# EAGLE design lcdi2c_shield (EAGLE 7.2.0)
CNAME: LCD i2c shield; CREVISION: 001; DESIGNER: M.Vagovszky
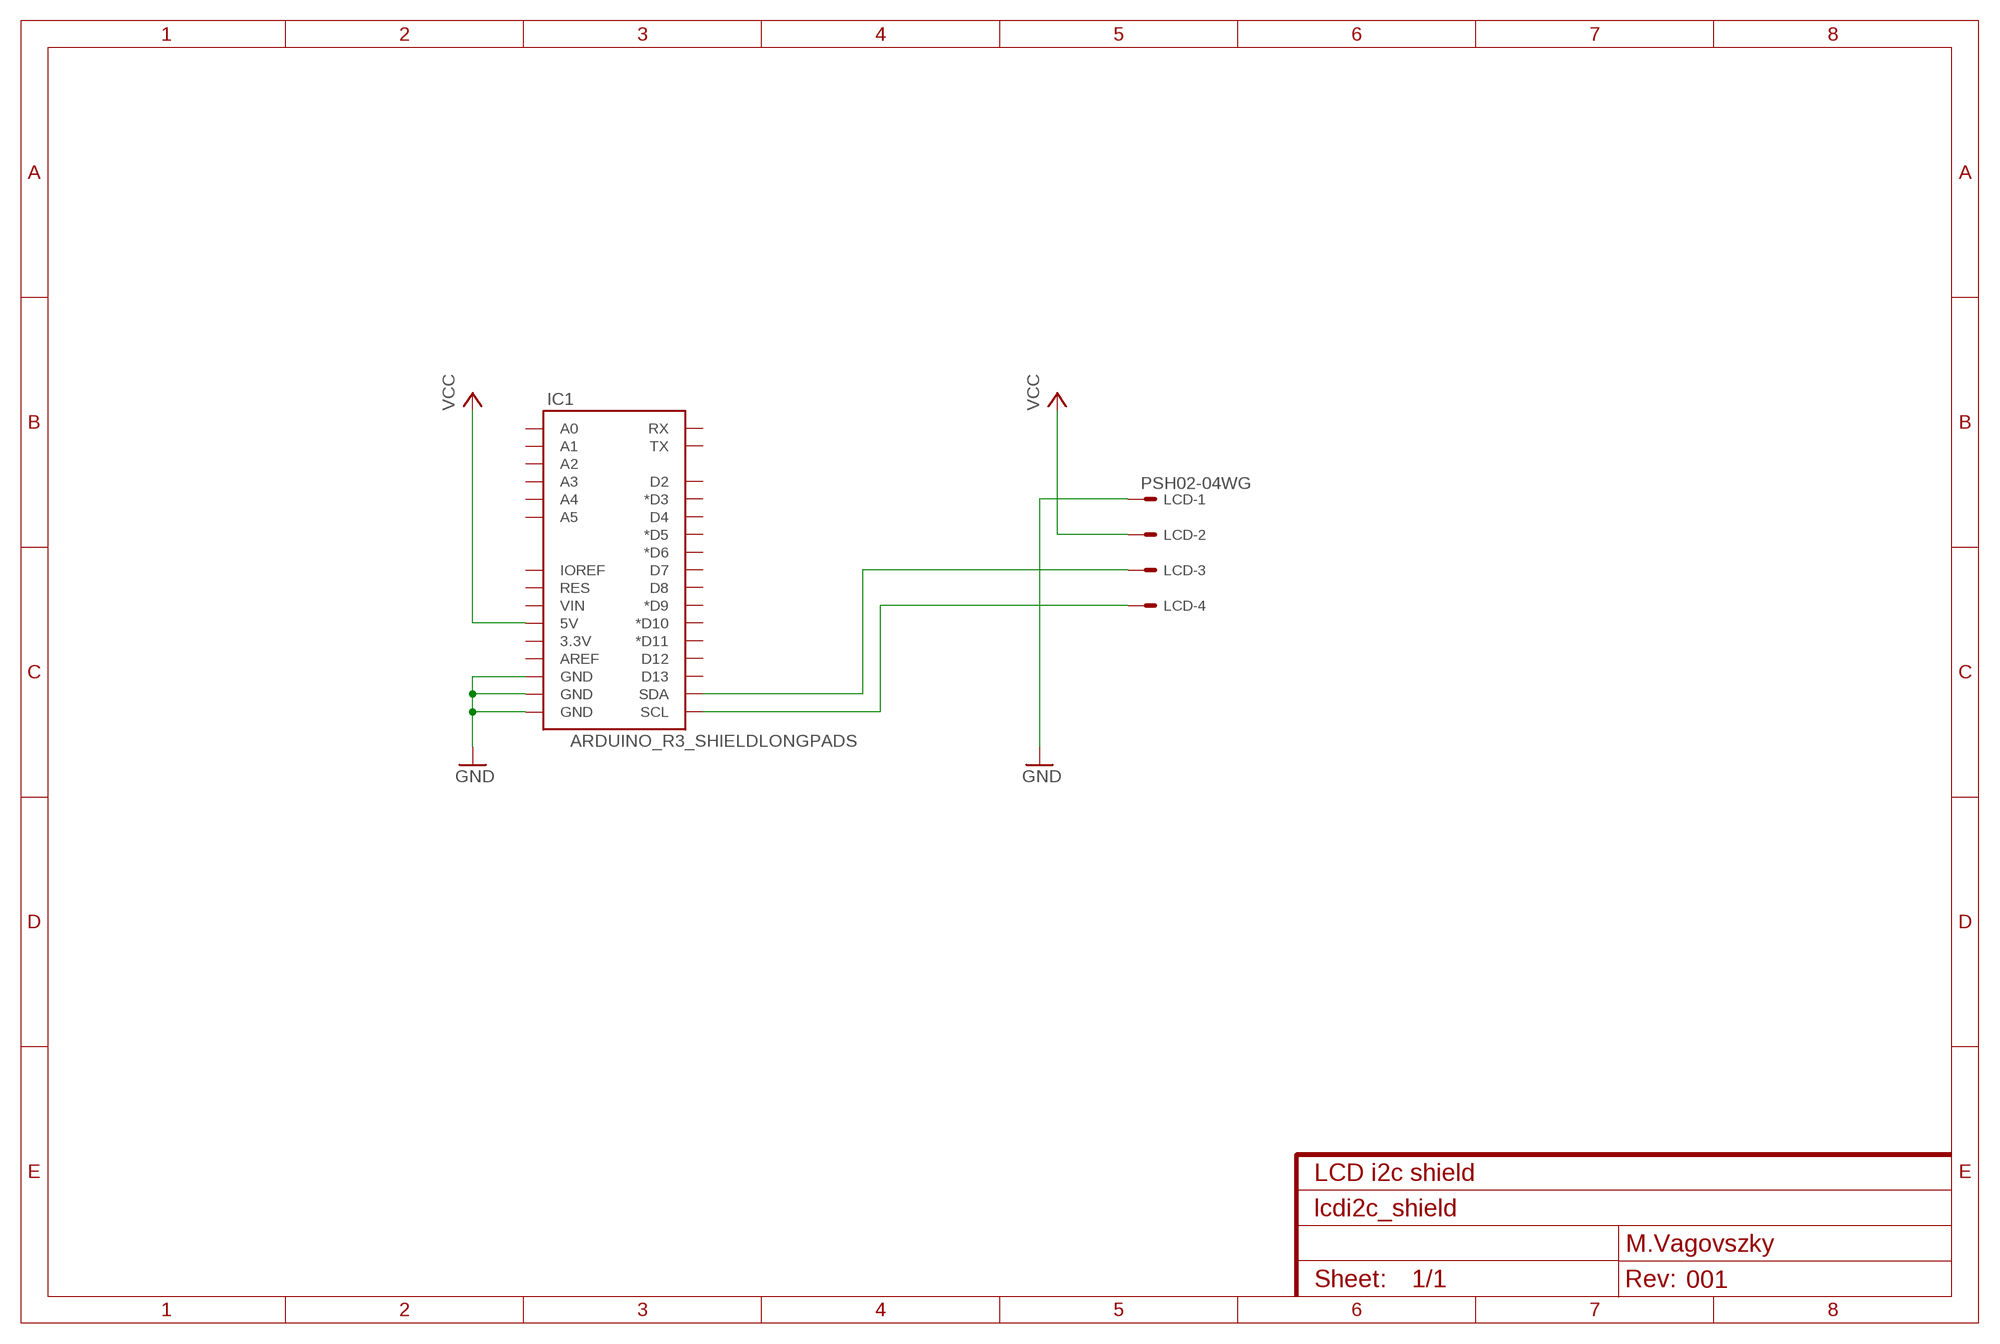
[diagram p0: schematic, sheet 1]

## Parts
IC1  ARDUINO_R3_SHIELDLONGPADS  [UNO_R3_SHIELD_LONGPADS]
LCD  PSH02-04WG  22-05-7048-04  [7395-04]

## Nets
GND: IC1.GND@0(GND) IC1.GND@1(GND) IC1.GND@2(GND) LCD.1
N$1: IC1.SDA LCD.3
N$2: IC1.SCL LCD.4
VCC: IC1.5V LCD.2
Unconnected: IC1.3.3V IC1.A0 IC1.A1 IC1.A2 IC1.A3 IC1.A4 IC1.A5 IC1.AREF IC1.D2 IC1.D3(*D3) IC1.D4 IC1.D5(*D5) IC1.D6(*D6) IC1.D7 IC1.D8 IC1.D9(*D9) IC1.D10(*D10) IC1.D11(*D11) IC1.D12 IC1.D13 IC1.IOREF IC1.RES IC1.RX IC1.TX IC1.VIN

## Library data of the parts
IC1 = My:ARDUINO_R3_SHIELD: Shield form compatible with the Arduino Uno R3.
LCD = con-molex:22-?-04: CONNECTOR wire to board 2.54 mm (.1 inch) pitch header; OC_FARNELL: unknown; OC_NEWARK: unknown

## Board
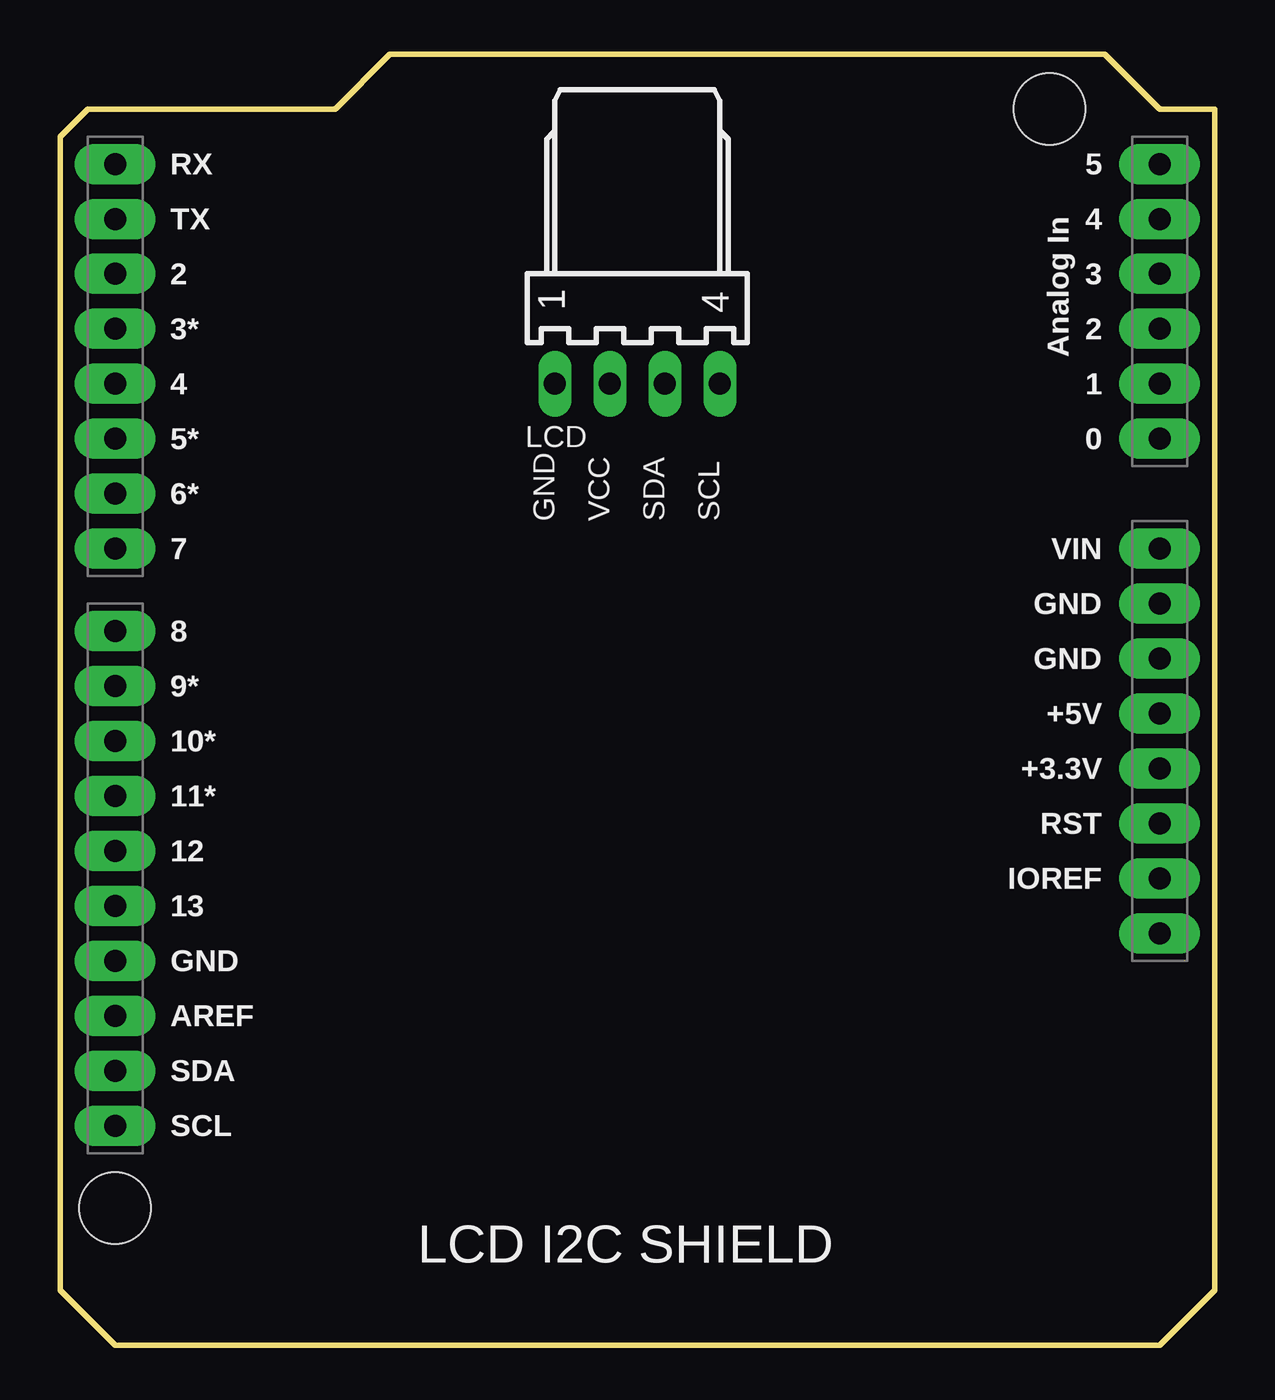
[diagram p1: board, top side]
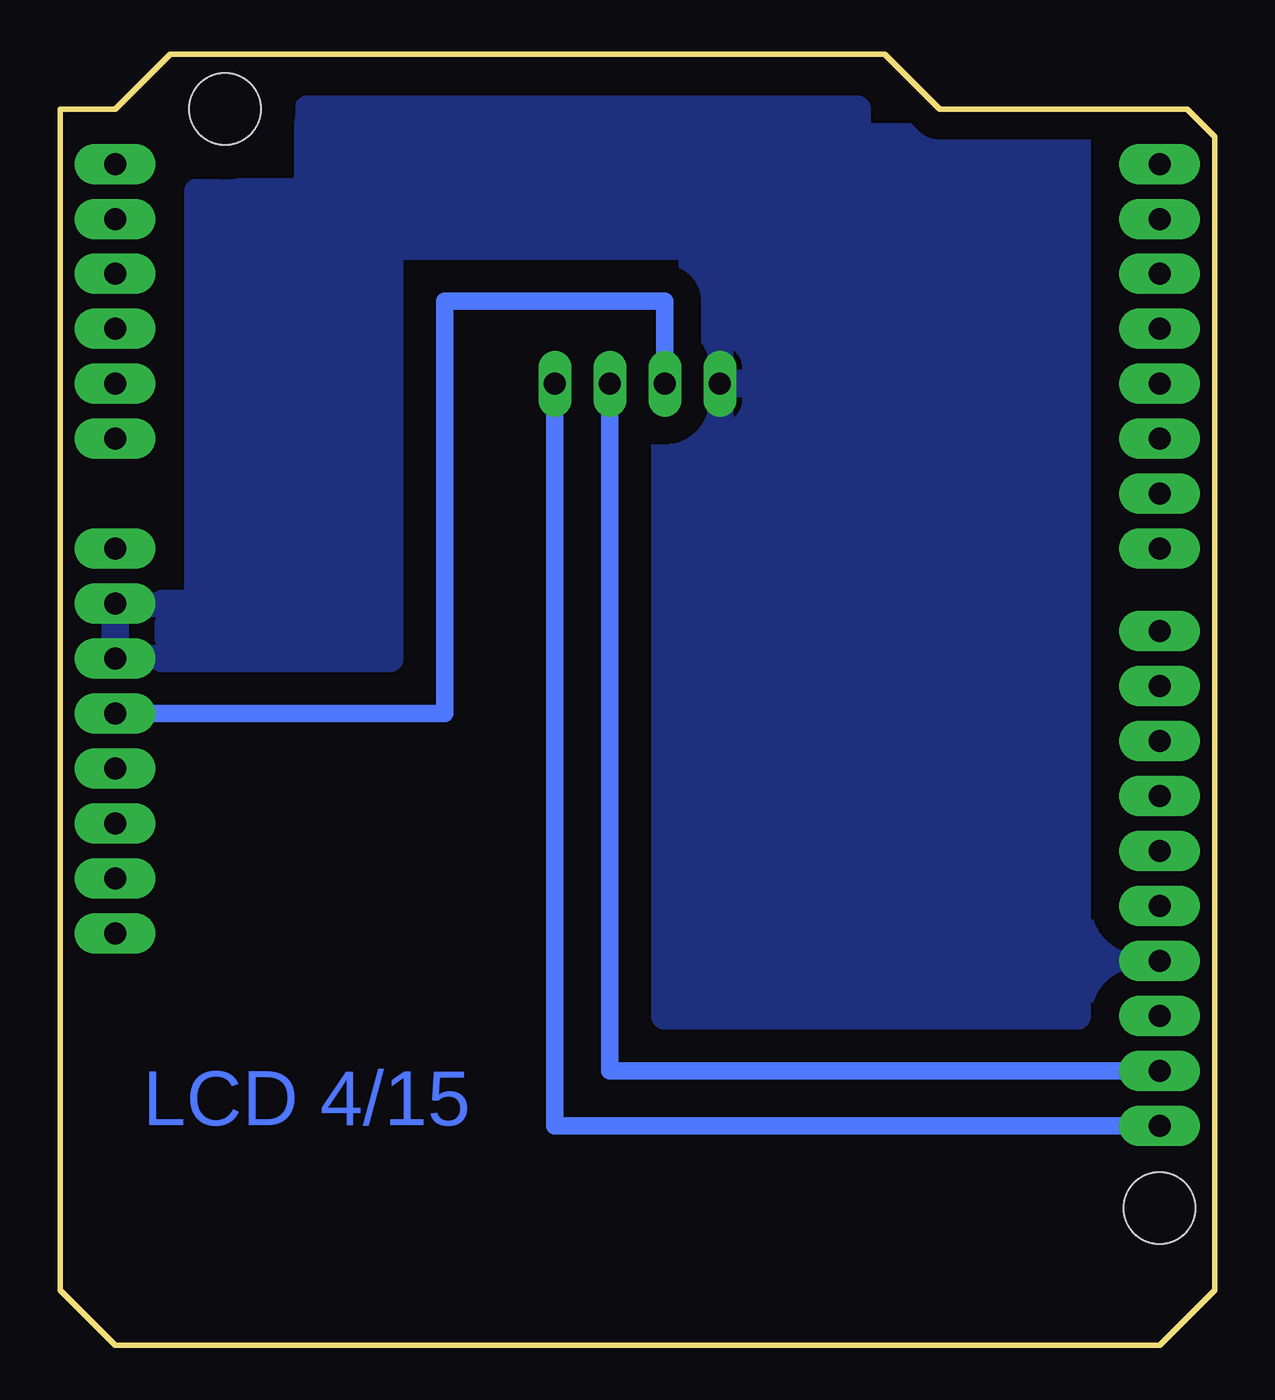
[diagram p2: board, bottom side, seen from below]

Size 53.34 x 59.69 mm. Coordinates in mm from the lower left corner, seen from the top.
Outline: 0,2.54 0,55.88 1.27,57.15 12.7,57.15 15.24,59.69 48.26,59.69 50.8,57.15 53.34,57.15 53.34,2.54 50.8,0 2.54,0 0,2.54
Copper layers (1*16): Top 0.035mm / dielectric 1.5mm / Bottom 0.035mm
Design rules "default": minimum track width 10mil, minimum drill 24mil, track to track 8mil, track to pad 8mil, pad to pad 8mil, via to via 8mil, smd to smd 8mil, copper to edge 40mil, drill to drill 8mil, minimum pad ring 10mil, minimum via ring 8mil, stop-mask expansion 4mil, vias tented up to drill 0mil, thermal gap 10mil

### Footprints (pad centres in the part's own frame; a part is rotated, then mirrored left to right if it is on the bottom)
UNO_R3_SHIELD_LONGPADS = drill 1.016 pad 1.88 long: 3.3V 50.8,26.67; 5V 50.8,29.21; A0 50.8,41.91; A1 50.8,44.45; A2 50.8,46.99; A3 50.8,49.53; A4 50.8,52.07; A5 50.8,54.61; AREF 2.54,15.24; D2 2.54,49.53; D3 2.54,46.99; D4 2.54,44.45; D5 2.54,41.91; D6 2.54,39.37; D7 2.54,36.83; D8 2.54,33.02; D9 2.54,30.48; D10 2.54,27.94; D11 2.54,25.4; D12 2.54,22.86; D13 2.54,20.32; GND@0 50.8,31.75; GND@1 50.8,34.29; GND@2 2.54,17.78; IOREF 50.8,21.59; NC 50.8,19.05; RES 50.8,24.13; RX 2.54,54.61; SCL 2.54,10.16; SDA 2.54,12.7; TX 2.54,52.07; VIN 50.8,36.83 | hole 3.302: 45.72,57.15; 2.54,6.35
7395-04 = drill 1.016 long: 1 3.81,0; 2 1.27,0; 3 -1.27,0; 4 -3.81,0

### Placement (x,y rotation side)
IC1  0,0 0 top
LCD  26.67,44.45 180 top

### Tracks (layer width: path | path; a pad name or v marks a point on that pad's centre or on a via)
GND
  pour Bottom (isolate 1.27): 6.35,55.88 6.35,19.05 2.54,19.05 2.54,16.51 6.35,16.51 6.35,15.24 25.4,15.24 25.4,41.91 24.13,41.91 24.13,49.53 24.13,50.8 38.1,50.8 38.1,49.53 38.1,31.75 52.07,31.75 52.07,34.29 48.26,34.29 46.99,34.29 46.99,53.34 41.91,53.34 41.91,57.15 16.51,57.15 16.51,55.88
N$1
  Bottom 0.813: IC1.SDA 27.94,12.7 LCD.3
N$2
  Bottom 0.813: IC1.SCL 30.48,10.16 LCD.4
VCC
  Bottom 0.813: LCD.2 25.4,48.26 35.56,48.26 35.56,29.21 IC1.5V

### Text on the board
Bottom: LCD 4/15
tNames: GND | VCC | SDA | SCL | LCD I2C SHIELD